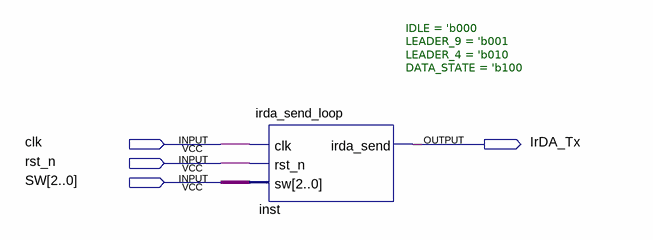
[diagram p0: schematic sheet]
// Quartus schematic IrDX_Send.bdf as structural Verilog: 1 symbols, 4 pins
module IrDX_Send (
  input  clk,
  input  rst_n,
  input  [2:0] SW,
  output IrDA_Tx
);

  irda_send_loop #(.IDLE('b000), .LEADER_9('b001), .LEADER_4('b010), .DATA_STATE('b100)) inst (
    .clk(clk), .rst_n(rst_n), .sw(SW), .irda_send(IrDA_Tx));
endmodule
